# Altium project RX_Mainboard_Round1.PrjPcb
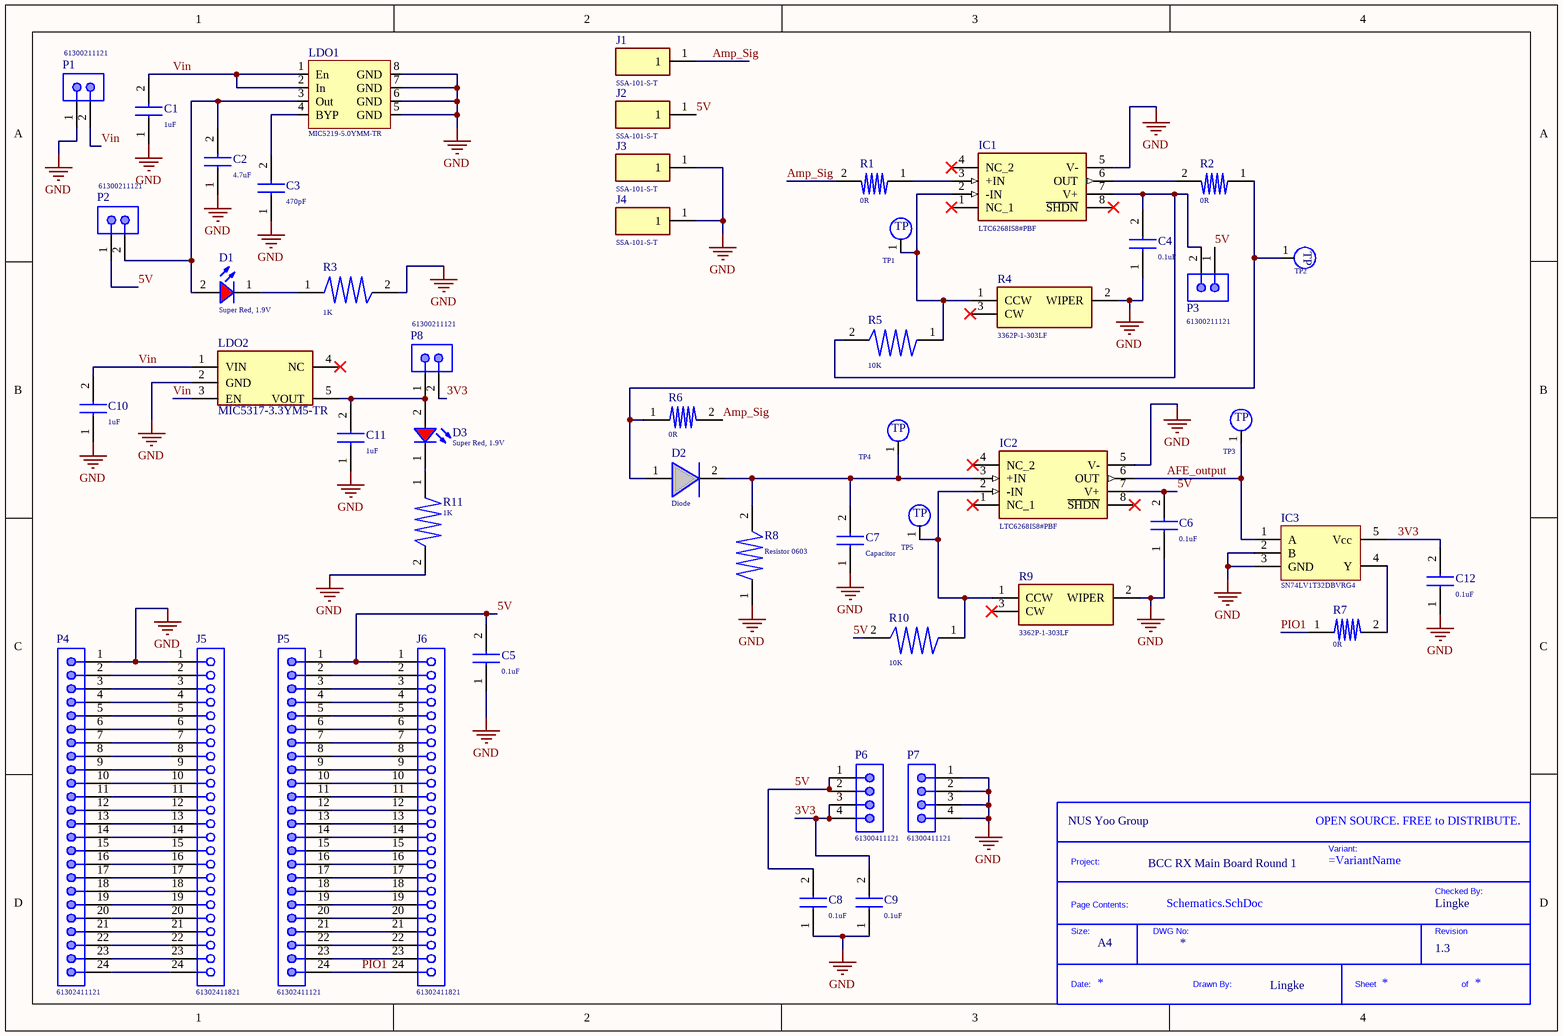
[diagram p0: Schematics.SchDoc]
1 sheet, 51 parts. Net scope: global (net labels, ports and power ports of the same name join across sheets).
Board file: Layout.PcbDoc

## Sheet Schematics.SchDoc
size A4

### Parts
*?  Project Name: BCC RX Main Board Round 1  Company: NUS Yoo Group  Drawn By: Lingke  Revision: 1.3  Size: A4  (hidden comment: Title_Block)  (no BOM)
C1  1uF  [0603]
C2  4.7uF  [0603]
C3  470pF  [0603]
C4  0.1uF  [0603]
C5  0.1uF  [0603]
C6  0.1uF  [0603]
C7  Capacitor  [0603]
C8  0.1uF  [0603]
C9  0.1uF  [0603]
C10  1uF  [0603]
C11  1uF  [0603]
C12  0.1uF  [0603]
D1  Super Red, 1.9V  [WL-SMCW_0603_H=0.7mm]
D2  Diode  [0603]
D3  Super Red, 1.9V  [WL-SMCW_0603_H=0.7mm]
IC1  LTC6268IS8#PBF  [SOIC127P599X175-8N]
IC2  LTC6268IS8#PBF  [SOIC127P599X175-8N]
IC3  SN74LV1T32DBVRG4  [SOT-23-5]
J1  SSA-101-S-T  [SSA-101-S-X]
J2  SSA-101-S-T  [SSA-101-S-X]
J3  SSA-101-S-T  [SSA-101-S-X]
J4  SSA-101-S-T  [SSA-101-S-X]
J5  61302411821  [61302411821]
J6  61302411821  [61302411821]
LDO1  MIC5219-5.0YMM-TR  [MSOP-8_MS]
LDO2  MIC5317-3.3YM5-TR  [SOT-23-5]
P1  61300211121  [61300211121]
P2  61300211121  [61300211121]
P3  61300211121  [61300211121]
P4  61302411121  [61302411121]
P5  61302411121  [61302411121]
P6  61300411121  [61300411121]
P7  61300411121  [61300411121]
P8  61300211121  [61300211121]
R1  0R  [0402]
R2  0R  [0402]
R3  1K  [0603]
R4  3362P-1-303LF  [3362P_1]
R5  10K  [0603]
R6  0R  [0402]
R7  0R  [0402]
R8  Resistor 0603  [0603]
R9  3362P-1-303LF  [3362P_1]
R10  10K  [0603]
R11  1K  [0603]
TP1  TP  [Test Point]  (value not drawn)  (no BOM)
TP2  TP  [Test Point]  (value not drawn)  (no BOM)
TP3  TP  [Test Point]  (value not drawn)  (no BOM)
TP4  TP  [Test Point]  (value not drawn)  (no BOM)
TP5  TP  [Test Point]  (value not drawn)  (no BOM)

### Nets
GND: C1.1 C2.1 C3.1 C4.1 C5.1 C6.1 C7.1 C8.1 C9.1 C10.1 C11.1 C12.1 IC1.5(V-) IC2.5(V-) IC3.2(B) IC3.3(GND) J3.1 J4.1 J5.1 LDO1.5(GND) LDO1.6(GND) LDO1.7(GND) LDO1.8(GND) LDO2.2(GND) P1.1 P4.1 P7.1 P7.2 P7.3 P7.4 R3.2 R4.2(WIPER) R8.1 R9.2(WIPER) R11.2
3V3: C9.2 C12.2 IC3.5(Vcc) P6.3 P6.4 P8.2
5V: C5.2 C6.2 C8.2 IC2.7(V+) J2.1 J6.1 P2.1 P3.1 P5.1 P6.1 P6.2 R10.2
AFE_output: IC2.6(OUT) IC3.1(A) TP3.1(TP)
Amp_Sig: J1.1 R1.2 R6.2
PIO1: J6.24 P5.24 R7.1
Vin: C1.2 C10.2 LDO1.1(En) LDO1.2(In) LDO2.1(VIN) LDO2.3(EN) P1.2
NetC2_2: C2.2 D1.2(A) LDO1.3(Out) P2.2
NetC3_2: C3.2 LDO1.4(BYP)
NetC4_2: C4.2 IC1.7(V+) P3.2 R5.2
NetC7_2: C7.2 D2.2 IC2.3(+IN) R8.2 TP4.1(TP)
NetC11_2: C11.2 D3.2(A) LDO2.5(VOUT) P8.1
NetD1_1: D1.1(K) R3.1
NetD2_1: D2.1 R2.1 R6.1 TP2.1(TP)
NetD3_1: D3.1(K) R11.1
NetIC1_2: IC1.2(-IN) R4.1(CCW) R5.1 TP1.1(TP)
NetIC1_3: IC1.3(+IN) R1.1
NetIC1_6: IC1.6(OUT) R2.2
NetIC2_2: IC2.2(-IN) R9.1(CCW) R10.1 TP5.1(TP)
NetIC3_4: IC3.4(Y) R7.2
NetJ5_2: J5.2 P4.2
NetJ5_3: J5.3 P4.3
NetJ5_4: J5.4 P4.4
NetJ5_5: J5.5 P4.5
NetJ5_6: J5.6 P4.6
NetJ5_7: J5.7 P4.7
NetJ5_8: J5.8 P4.8
NetJ5_9: J5.9 P4.9
NetJ5_10: J5.10 P4.10
NetJ5_11: J5.11 P4.11
NetJ5_12: J5.12 P4.12
NetJ5_13: J5.13 P4.13
NetJ5_14: J5.14 P4.14
NetJ5_15: J5.15 P4.15
NetJ5_16: J5.16 P4.16
NetJ5_17: J5.17 P4.17
NetJ5_18: J5.18 P4.18
NetJ5_19: J5.19 P4.19
NetJ5_20: J5.20 P4.20
NetJ5_21: J5.21 P4.21
NetJ5_22: J5.22 P4.22
NetJ5_23: J5.23 P4.23
NetJ5_24: J5.24 P4.24
NetJ6_2: J6.2 P5.2
NetJ6_3: J6.3 P5.3
NetJ6_4: J6.4 P5.4
NetJ6_5: J6.5 P5.5
NetJ6_6: J6.6 P5.6
NetJ6_7: J6.7 P5.7
NetJ6_8: J6.8 P5.8
NetJ6_9: J6.9 P5.9
NetJ6_10: J6.10 P5.10
NetJ6_11: J6.11 P5.11
NetJ6_12: J6.12 P5.12
NetJ6_13: J6.13 P5.13
NetJ6_14: J6.14 P5.14
NetJ6_15: J6.15 P5.15
NetJ6_16: J6.16 P5.16
NetJ6_17: J6.17 P5.17
NetJ6_18: J6.18 P5.18
NetJ6_19: J6.19 P5.19
NetJ6_20: J6.20 P5.20
NetJ6_21: J6.21 P5.21
NetJ6_22: J6.22 P5.22
NetJ6_23: J6.23 P5.23

Not connected (* = marked no-connect by the designer): IC1 1(NC_1)* 4(NC_2)* 8(~{SHDN})*; IC2 1(NC_1)* 4(NC_2)* 8(~{SHDN})*; LDO2 4(NC)*; R4 3(CW)*; R9 3(CW)*

### Notes on the sheet
- (in symbol Title_Block) OPEN SOURCE. FREE to DISTRIBUTE.; Variant:; Project:; Checked By:; Page Contents:; Size:; DWG No:; Revision; Date:; Drawn By:; Sheet; of

### Library data of the parts
*? = Title_Block: Standard Title Block.; DWG No: *; Checked By: Lingke
C1-C6 C8-C12 = Capacitor
D1 D3 = 150060SS75000: WL-SMCW SMT Mono-color Chip LED Waterclear, size 0603, Super Red, 1.9V, 140deg; Chip Technology: AlInGaP; Dominant Wavelength typ.: 630nm; Luminous Intensity typ.: 60mcd; Peak Wavelength typ.: 645nm; Viewing Angle: 140deg; ComponentLink1Description: Manufacturer; ComponentLink1URL: http://www.we-online.de; ComponentLink2URL: https://www.we-online.com/catalog/datasheet/150060SS75000.pdf; ComponentLink2Description: Datasheet; Forward Voltage typ.: 1.9V; Emitting Color: Super Red; Mounting Technology: SMT; Operating Temperature: -40 to +85degC; Published Date: December 2019; Part Number: 150060SS75000; Packaging: Tape and Reel; Size: 0603; Publisher: Wurth Elektronik
IC1 IC2 = LTC6268IS8#PBF: Integrated Circuit; Manufacturer_Name: Linear Technology; Datasheet Link: https://componentsearchengine.com//LTC6268IS8#PBF.pdf; Height: 1.752mm; Mouser2 Part Number: 584-LTC6268IS8#PBF; Mouser2 Price/Stock: https://www.mouser.com/Search/Refine.aspx?Keyword=584-LTC6268IS8%23PBF; Manufacturer_Part_Number: LTC6268IS8#PBF
J1-J4 = SSA-101-S-T: Connector; Manufacturer_Name: SAMTEC; Datasheet Link: http://suddendocs.samtec.com/prints/ssas-mkt.pdf; Manufacturer_Part_Number: SSA-101-S-T
J5 J6 = 61302411821: WR-PHD Socket Header, THT, pitch 2.54mm, Single Row, Vertical, 24p; Manufacturer: Wurth Elektronik; Pin Number: 24; Rated Current: 3A; Working Voltage: 250VAC; Withstanding Voltage: 500VAC; Contact Resistance: 20mOhm; ComponentLink1Description: Manufacturer; ComponentLink1URL: http://www.we-online.de; ComponentLink2Description: Datasheet; ComponentLink2URL: https://www.we-online.com/catalog/datasheet/61302411821.pdf; Manufacturer Part Number: 61302411821; Published Date: May 2020; Pitch: 2.54mm; Operating Temperature: -40 to +125degC; Mounting Technology: THT; Packaging: Tray; Gender: Socket Header; Row Number: Single; Orientation: Vertical
LDO2 = MIC5317-3.3YM5-TR: Power Supply; Manufacturer_Name: Microchip; Datasheet Link: https://componentsearchengine.com//MIC5317-3.3YM5-TR.pdf; Height: 1mm; Mouser2 Part Number: 998-MIC5317-3.3YM5TR; Mouser2 Price/Stock: https://www.mouser.com/Search/Refine.aspx?Keyword=998-MIC5317-3.3YM5TR; Manufacturer_Part_Number: MIC5317-3.3YM5-TR
P1-P3 P8 = 61300211121: WR-PHD Pin Header, THT, pitch 2.54mm, Single Row, Vertical, 2p; Manufacturer: Wurth Elektronik; Pin Number: 2; Rated Current: 3A; Working Voltage: 250VAC; Withstanding Voltage: 500VAC; Contact Resistance: 20mOhm; ComponentLink1Description: Manufacturer; ComponentLink1URL: http://www.we-online.de; ComponentLink2Description: Datasheet; ComponentLink2URL: https://www.we-online.com/catalog/datasheet/61300211121.pdf; Manufacturer Part Number: 61300211121; Published Date: May 2020; Pitch: 2.54mm; Operating Temperature: -40 to +105degC; Mounting Technology: THT; Packaging: Bag; Gender: Pin Header; Row Number: Single; Orientation: Vertical
P4 P5 = 61302411121: WR-PHD Pin Header, THT, pitch 2.54mm, Single Row, Vertical, 24p; Manufacturer: Wurth Elektronik; Pin Number: 24; Rated Current: 3A; Working Voltage: 250VAC; Withstanding Voltage: 500VAC; Contact Resistance: 20mOhm; ComponentLink1Description: Manufacturer; ComponentLink1URL: http://www.we-online.de; ComponentLink2Description: Datasheet; ComponentLink2URL: https://www.we-online.com/catalog/datasheet/61302411121.pdf; Manufacturer Part Number: 61302411121; Published Date: May 2020; Pitch: 2.54mm; Operating Temperature: -40 to +105degC; Mounting Technology: THT; Packaging: Bag; Gender: Pin Header; Row Number: Single; Orientation: Vertical
P6 P7 = 61300411121: WR-PHD Pin Header, THT, pitch 2.54mm, Single Row, Vertical, 4p; Manufacturer: Wurth Elektronik; Pin Number: 4; Rated Current: 3A; Working Voltage: 250VAC; Withstanding Voltage: 500VAC; Contact Resistance: 20mOhm; ComponentLink1Description: Manufacturer; ComponentLink1URL: http://www.we-online.de; ComponentLink2Description: Datasheet; ComponentLink2URL: https://www.we-online.com/catalog/datasheet/61300411121.pdf; Manufacturer Part Number: 61300411121; Published Date: May 2020; Pitch: 2.54mm; Operating Temperature: -40 to +105degC; Mounting Technology: THT; Packaging: Bag; Gender: Pin Header; Row Number: Single; Orientation: Vertical
R1 R2 R6 R7 = Resistor 0402
R3 R5 R8 R10 R11 = Resistor 0603: Resistor
R4 R9 = 3362P-1-303LF: Resistor; Manufacturer_Name: Bourns; Manufacturer_Part_Number: 3362P-1-303LF
TP1-TP5 = Test Point: Test Point 1mm by 1mm
IC3 = SN74LV1T32DBVRG4: Supplier 1: Mouser; Supplier Part Number 1: 595-SN74LV1T32DBVRG4